# Altium schematic sheet STM32G0B1CBT6TR.SchDoc
size 594 x 420 mm; SheetNumber: 2; SheetTotal: 4
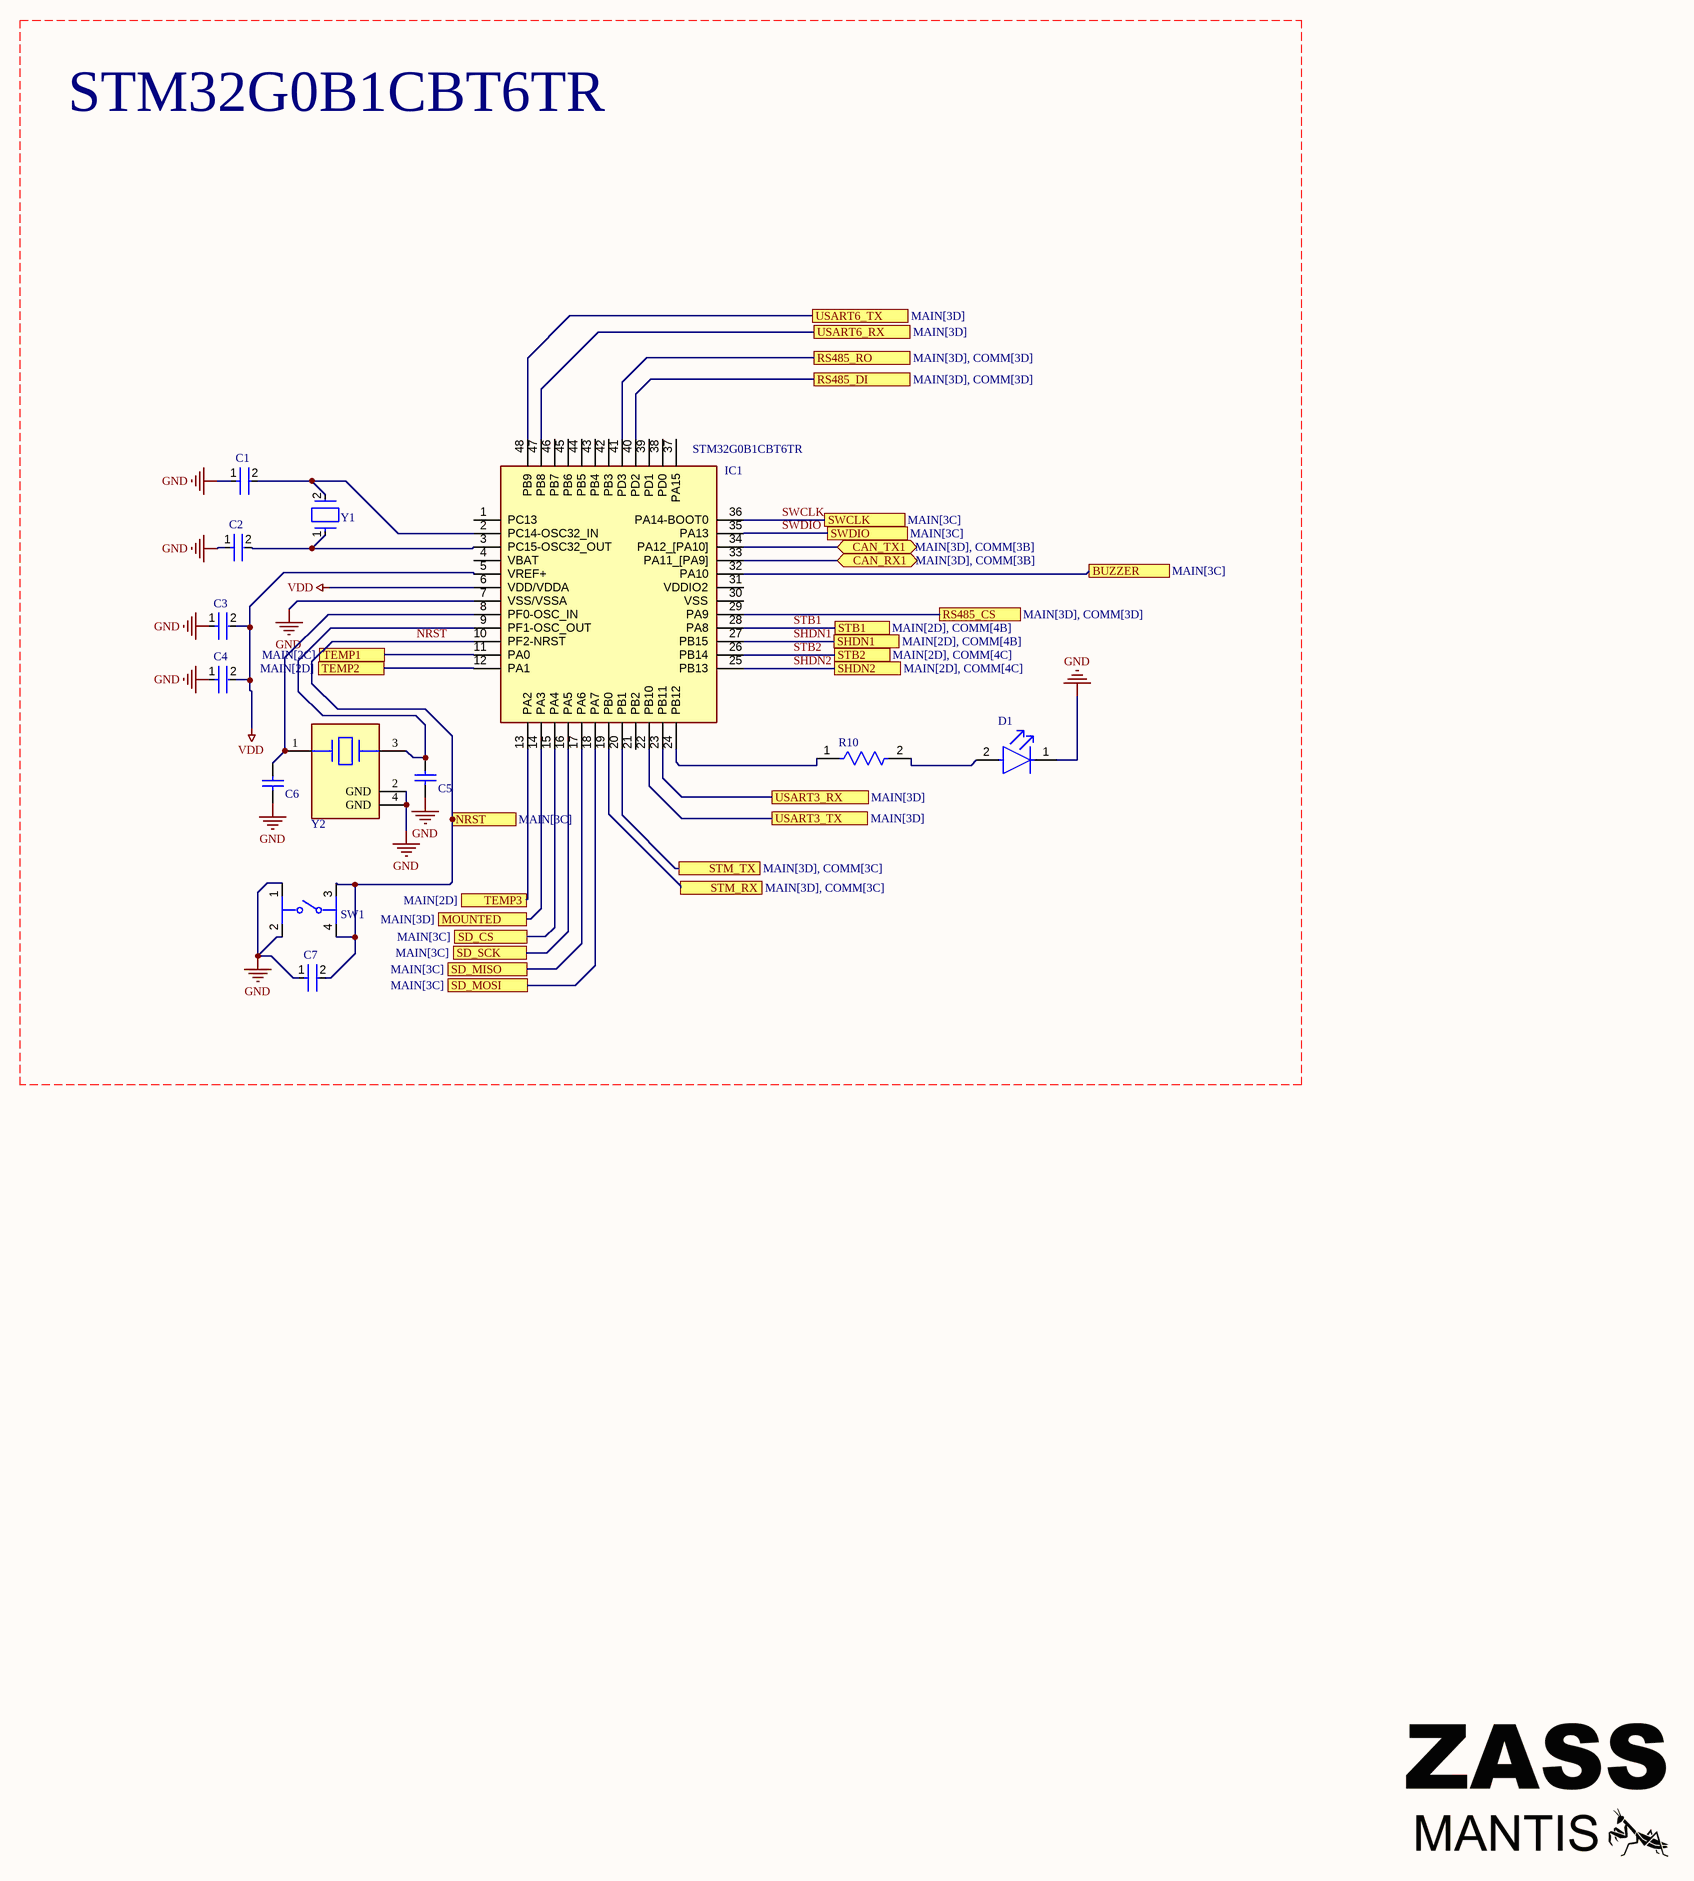
[diagram p0: STM32G0B1CBT6TR.SchDoc]

## Parts
C1  C0805C519D3HACTU  [FP-C0805C-DN-MFG]  (value not drawn)
C2  C0805C519D3HACTU  [FP-C0805C-DN-MFG]  (value not drawn)
C3  C0805C104K5RACTU  [FP-C0805C-DN-MFG]  (value not drawn)
C4  C0805C104K5RACTU  [FP-C0805C-DN-MFG]  (value not drawn)
C5  GRM1885C1H100JA01D  [CAPC1608X90X35LL10T15]  (value not drawn)
C6  GRM1885C1H100JA01D  [CAPC1608X90X35LL10T15]  (value not drawn)
C7  C0805C104K5RACTU  [FP-C0805C-DN-MFG]  (value not drawn)
D1  LTST-C230EKT  [FP-LTST-C230EKT-MFG]  (value not drawn)
IC1  STM32G0B1CBT6TR  [QFP50P900X900X160-48N]
R10  CRGCQ1206F1K0  [FP-CRGCQ1206-IPC_C]  (value not drawn)
SW1  PTS647SK38SMTR2LFS  [FP-PTS647SK38SMTR2LFS-MFG]  (value not drawn)
Y1  ABS06-32.768KHZ-9-1-T  [FP-ABS06-MFG]  (value not drawn)
Y2  ABM8G-24.000MHZ-B4Y-T  [FP-ABM8G-MFG]  (value not drawn)

## Ports
BUZZER (see MAIN[3C]), CAN_RX1 (bidir, see MAIN[3D], COMM[3B]), CAN_TX1 (bidir, see MAIN[3D], COMM[3B]), MOUNTED (see MAIN[3D]), NRST (see MAIN[3C]), RS485_CS (see MAIN[3D], COMM[3D]), RS485_DI (see MAIN[3D], COMM[3D]), RS485_RO (see MAIN[3D], COMM[3D]), SD_CS (see MAIN[3C]), SD_MISO (see MAIN[3C]), SD_MOSI (see MAIN[3C]), SD_SCK (see MAIN[3C]), SHDN1 (see MAIN[2D], COMM[4B]), SHDN2 (see MAIN[2D], COMM[4C]), STB1 (see MAIN[2D], COMM[4B]), STB2 (see MAIN[2D], COMM[4C]), STM_RX (see MAIN[3D], COMM[3C]), STM_TX (see MAIN[3D], COMM[3C]), SWCLK (see MAIN[3C]), SWDIO (see MAIN[3C]), TEMP1 (see MAIN[2C]), TEMP2 (see MAIN[2D]), TEMP3 (see MAIN[2D]), USART3_RX (see MAIN[3D]), USART3_TX (see MAIN[3D]), USART6_RX (see MAIN[3D]), USART6_TX (see MAIN[3D])

## Nets
GND: C1.1 C2.1 C3.1 C4.1 C5.1 C6.1 C7.1 D1.1(C) IC1.7(VSS/VSSA) SW1.1 SW1.2 Y2.2(GND) Y2.4(GND)
VDD: C3.2 C4.2 IC1.5(VREF+) IC1.6(VDD/VDDA)
BUZZER: IC1.32(PA10) ; port BUZZER
CAN_RX1: IC1.33(PA11_[PA9]) ; port CAN_RX1
CAN_TX1: IC1.34(PA12_[PA10]) ; port CAN_TX1
MOUNTED: IC1.14(PA3) ; port MOUNTED
NRST: C7.2 IC1.10(PF2-NRST) IC1.11(PA0) SW1.3 SW1.4 ; port TEMP1, port NRST
RS485_CS: IC1.29(PA9) ; port RS485_CS
RS485_DI: IC1.40(PD2) ; port RS485_DI
RS485_RO: IC1.41(PD3) ; port RS485_RO
SD_CS: IC1.15(PA4) ; port SD_CS
SD_MISO: IC1.17(PA6) ; port SD_MISO
SD_MOSI: IC1.18(PA7) ; port SD_MOSI
SD_SCK: IC1.16(PA5) ; port SD_SCK
SHDN1: IC1.27(PB15) ; port SHDN1
SHDN2: IC1.25(PB13) ; port SHDN2
STB1: IC1.28(PA8) ; port STB1
STB2: IC1.26(PB14) ; port STB2
STM_RX: IC1.19(PB0) ; port STM_RX
STM_TX: IC1.20(PB1) ; port STM_TX
SWCLK: IC1.36(PA14-BOOT0) ; port SWCLK
SWDIO: IC1.35(PA13) ; port SWDIO
TEMP2: IC1.12(PA1) ; port TEMP2
TEMP3: IC1.13(PA2) ; port TEMP3
USART3_RX: IC1.23(PB11) ; port USART3_RX
USART3_TX: IC1.22(PB10) ; port USART3_TX
USART6_RX: IC1.47(PB8) ; port USART6_RX
USART6_TX: IC1.48(PB9) ; port USART6_TX
NetC1_2: C1.2 IC1.2(PC14-OSC32_IN) Y1.2
NetC2_2: C2.2 IC1.3(PC15-OSC32_OUT) Y1.1
NetC5_2: C5.2 IC1.9(PF1-OSC_OUT) Y2.3
NetC6_2: C6.2 IC1.8(PF0-OSC_IN) Y2.1
NetD1_2: D1.2(A) R10.2
NetIC1_24: IC1.24(PB12) R10.1

Not connected (* = marked no-connect by the designer): IC1 1(PC13) 4(VBAT) 21(PB2) 30(VSS) 31(VDDIO2) 37(PA15) 38(PD0) 39(PD1) 42(PB3) 43(PB4) 44(PB5) 45(PB6) 46(PB7)

## Notes on the sheet
- STM32G0B1CBT6TR
- DWG NO:
- REV:
- THIS DOCUMENT AND THE DATA DISCLOSED HEREIN OR
- HEREWITH IS THE PROPERTY OF ALTIUM LIMITED AND MAY
- BE FREELY DISTRIBUTED IN WHOLE. NO RIGHTS ARE
- RESERVED OR EXPRESS OR IMPLIED WARANTEE GIVEN.
- REVISION
- DESCRIPTION
- DATE
- APPROVED
- PROJECT
- PROJECT REVISION:
- TITLE
- A2
- SIZE
- FILE NAME
- SHEET
- OF

## Library data of the parts
C1 C2 = CMP-03020-033346-1: C0805 5.1 pF X8R 30ppm/°C 0.5 pF 25 V; Manufacturer: KEMET; Voltage Rating: 25 V; Tolerance: 0.5 pF; Capacitance: 5.1 pF; Value: 5.1 pF; Material: Ceramic; Category: Cap; Lead Free: Yes; Temperature Characteristic: X8R; Manufacturer Part Number: C0805C519D3HACTU; Ipc Land Pattern Name: CAPC200125X78; ComponentLink2Description: Datasheet; Package: C0805C-DN; Device Class L2: Capacitors; Automotive: No; Octopart: https://octopart.com/c0805c519d3hactu-kemet-88727353; Device Class L1: Passive Components; Temperature Coefficient: 30ppm/°C; Temperature Range High: +125°C; Height: 0.88mm; Temperature Range Low: -55°C; ComponentLink2URL: https://content.kemet.com/datasheets/KEM_C1003_C0G_SMD.pdf; Device Class L3: Ceramic Capacitors; RoHS: TRUE; Temperature: -55°C to +125°C
C3 C4 C7 = CMP-2007-00279-2: CAP CER 0.1UF 50V X7R 0805; Manufacturer: KEMET; Value: 0.10 μF; Tolerance: 0.1; Temperature Coefficient: 30ppm/°C; Material: Ceramic; Manufacturer Part Number: C0805C104K5RACTU; Device Class L2: Capacitors; Temperature Range Low: -55°C; Voltage Rating: 50 V; Digikey Description: CAP CER 0.1UF 50V X7R 0805; Category: Cap; ComponentLink2Description: Datasheet; Octopart: https://octopart.com/c0805c104k5ractu-kemet-143926; RoHS: TRUE; ComponentLink2URL: https://content.kemet.com/datasheets/KEM_C1003_C0G_SMD.pdf; Temperature Characteristic: X7R; Temperature: -55°C to +125°C; Height: 0.88mm; Temperature Range High: +125°C; Device Class L1: Passive Components; Automotive: No; Lead Free: Yes; Ipc Land Pattern Name: CAPC200125X78; Device Class L3: Ceramic Capacitors; Mouser Description: Cap Ceramic 0.1uF 50V X7R 10% SMD 2.0 x 1.2 mm 125 C Paper T/R; Capacitance: 0.10 μF; Package: C0805C-DN
C5 C6 = CMP-2006-02592-1: Manufacturer: Murata; Part Number: GRM1885C1H100JA01D
D1 = CMP-22017-000030-1: LED RED CLEAR CHIP SMD; Forward Current: 30mA; Test Current: 10mA; Number of Elements: 1; Viewing Angle: 130°; Dominant Wavelength: 621nm; Forward Voltage: 2V; Lens Style: Diffused; Power Rating: 100mW; Reverse Voltage: 5V; Wavelength: 630nm; Luminous Intensity: 6mcd; Lens Color: Colorless; Case/Package: 1206; Case Code (Imperial): 1206; Package Quantity: 1; Lead Free: Lead Free; Case Code (Metric): 3216; Height: 1.1mm; Lens Transparency: Clear; Mount: Surface Mount; Depth: 1.6mm; Number of LEDs: 1; Power Dissipation: 100mW; Max Operating Temperature: 85°C; Width: 1.6mm; Color: Red; Number of Pins: 2; Min Operating Temperature: -55°C; Packaging: Tape and Reel; Radiation Hardening: No; Illumination Color: Red; Length: 3.2mm
IC1 = STM32G0B1CBT6TR: Integrated Circuit; Manufacturer_Name: STMicroelectronics; Datasheet Link: https://www.st.com/resource/en/datasheet/stm32g0b1cc.pdf; Height: 1.6mm; Manufacturer_Part_Number: STM32G0B1CBT6TR; Mouser Part Number: 511-STM32G0B1CBT6TR; Mouser Price/Stock: https://www.mouser.co.uk/ProductDetail/STMicroelectronics/STM32G0B1CBT6TR?qs=HoCaDK9Nz5cqFCA6TLpp%252Bw%3D%3D; Arrow Part Number: STM32G0B1CBT6TR; Arrow Price/Stock: https://www.arrow.com/en/products/stm32g0b1cbt6tr/stmicroelectronics?utm_currency=USD&region=nac
R10 = CMP-03211-006592-1: CRGCQ1206 1KΩ 0.25W 1% ±100ppm/°C 200V; Manufacturer: TE Connectivity; Automotive Grade: Grade 685; Tolerance: 0.01; Ipc Land Pattern Name: RESC310155X55; Temperature Range Low: -55°C; Device Class L3: Chip SMD Resistors; ComponentLink2URL: https://www.te.com/commerce/DocumentDelivery/DDEController?Action=showdoc&DocId=Data+Sheet%7F1773204-3%7F1%7Fpdf%7FEnglish%7FENG_DS_1773204-3_1.pdf%7F4-2176347-694; Automotive: Yes; Temperature: -55°C to +155°C; Manufacturer Part Number: CRGCQ1206F1K0; Package: CRGCQ1206; Octopart: https://octopart.com/crgcq1206f1k0-te+connectivity-91018258; Device Class L1: Passive Components; Series: CRGCQ; Device Class L2: Resistors; RoHS: TRUE; Lead Free: Yes; ComponentLink2Description: Datasheet; Power Rating: 0.25W; Temperature Coefficient: ±100ppm/°C; Value: 1KΩ; Voltage Rating: 200V; Temperature Range High: +155°C; Height: 0.65mm; Category: Res; Resistance: 1KΩ; Composition: Thick Film; Ambient Temperature Range High: +70°C
SW1 = CMP-10040-000033-1: TACT 4.5 X 4.5, 3.8 MM H, 2.5N,; Switch Function: Off-Mom; Switch Travel: 0.25mm; Actuator Type: Standard; Illumination Type: Non-Illuminated; Mechanical Life: 100000Cycles; Ratings: IP40; Operating Force: 250gf; Throw Configuration: SPST; Max Operating Temperature: 70°C; Min Operating Temperature: -20°C; Termination: Gull Wing; Mount: Surface Mount; Packaging: Tape and Reel
Y1 = CMP-27762-003430-2: Crystal 32.768kHz ±10ppm (Tol) 9pF FUND 90kΩ 2-Pin Mini-CSMD T/R; Series Resistance: 90kR; Series: ABS06; Case/Package: CSMD; Package Quantity: 3000; Load Capacitance: 9pF; Number of Pins: 2; Tolerance: 10ppm; RoHS Compliant: Yes; Depth: 1.2mm; Termination: SMD/SMT; Min Operating Temperature: -40°C; Length: 2mm; Packaging: Tape and Reel; Max Operating Temperature: 85°C; Frequency Tolerance: 10ppm; Width: 1.2mm; ESR (Equivalent Series Resistance): 90kR; Radiation Hardening: No; Frequency: 32.768kHz; REACH SVHC: No SVHC; Mount: Surface Mount; Height: 0.6mm
Y2 = CMP-27762-015229-1: Crystal 24MHz ±30ppm (Tol) ±30ppm (Stability) 10pF FUND 60Ω 4-Pin SMD T/R; Series Resistance: 60R; Width: 2.5mm; Case/Package: CSMD; Load Capacitance: 10pF; Max Operating Temperature: 70°C; Depth: 2.5mm; Min Operating Temperature: -20°C; Frequency Stability: 30ppm; Frequency Tolerance: 30ppm; Frequency: 24MHz; Length: 3.2mm; Height: 1mm; Mount: Surface Mount; Lead Free: Lead Free; Tolerance: 30ppm; ESR (Equivalent Series Resistance): 60R; Number of Pins: 4; Termination: SMD/SMT; Operating Frequency: 24 MHz; Package Quantity: 1000; Series: ABM8G; Packaging: Tape and Reel